# Altium schematic sheet [11]SERIAL_PORT.SchDoc
size B
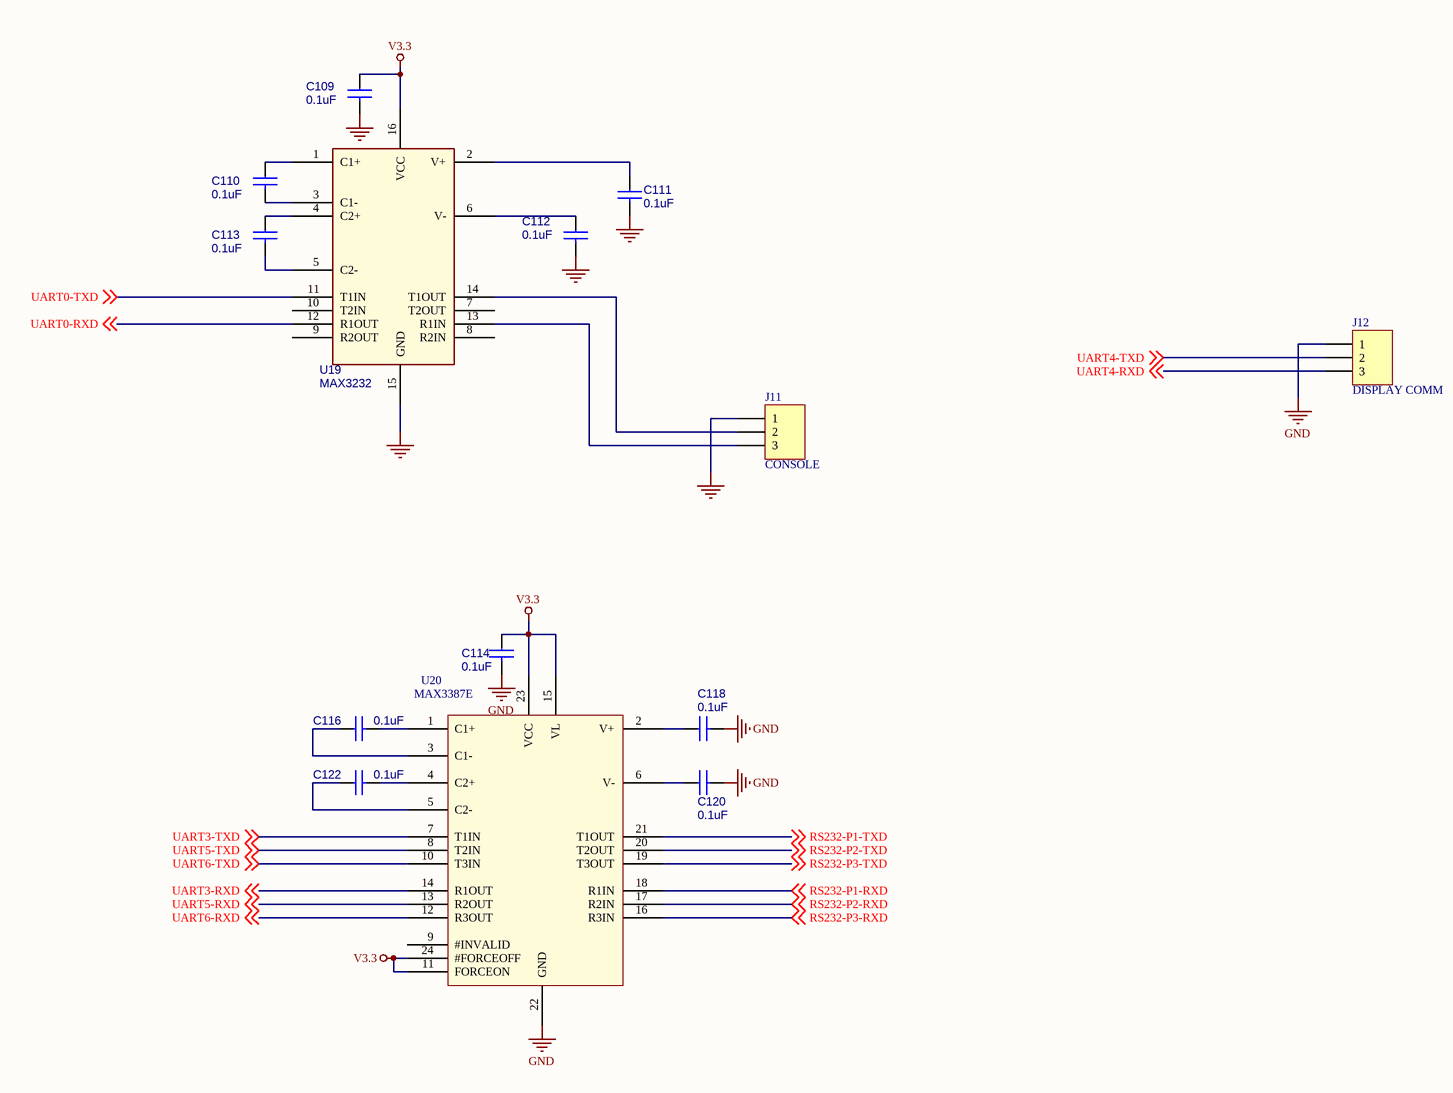
[diagram p0: [11]SERIAL_PORT.SchDoc]

## Parts
C109  0.1uF  [0603]
C110  0.1uF  [0603]
C111  0.1uF  [0603]
C112  0.1uF  [0603]
C113  0.1uF  [0603]
C114  0.1uF  [0603]
C116  0.1uF  [0603]
C118  0.1uF  [0603]
C120  0.1uF  [0603]
C122  0.1uF  [0603]
J11  CONSOLE  [CONN-3P]
J12  DISPLAY COMM  [CONN-3P]
U19  MAX3232  [SO-16]
U20  MAX3387E  [SSOP24]

## Nets
GND: C109.2 C111.2 C112.2 C114.2 C118.2 C120.2 J11.1 J12.1 U19.15(GND) U20.22(GND)
V3.3: C109.1 C114.1 U19.16(VCC) U20.11(FORCEON) U20.15(VL) U20.23(VCC) U20.24(#FORCEOFF)
RS232-P1-RXD: U20.18(R1IN) ; off-sheet RS232-P1-RXD
RS232-P1-TXD: U20.21(T1OUT) ; off-sheet RS232-P1-TXD
RS232-P2-RXD: U20.17(R2IN) ; off-sheet RS232-P2-RXD
RS232-P2-TXD: U20.20(T2OUT) ; off-sheet RS232-P2-TXD
RS232-P3-RXD: U20.16(R3IN) ; off-sheet RS232-P3-RXD
RS232-P3-TXD: U20.19(T3OUT) ; off-sheet RS232-P3-TXD
UART0-RXD: U19.12(R1OUT) ; off-sheet UART0-RXD
UART0-TXD: U19.11(T1IN) ; off-sheet UART0-TXD
UART3-RXD: U20.14(R1OUT) ; off-sheet UART3-RXD
UART3-TXD: U20.7(T1IN) ; off-sheet UART3-TXD
UART4-RXD: J12.3 ; off-sheet UART4-RXD
UART4-TXD: J12.2 ; off-sheet UART4-TXD
UART5-RXD: U20.13(R2OUT) ; off-sheet UART5-RXD
UART5-TXD: U20.8(T2IN) ; off-sheet UART5-TXD
UART6-RXD: U20.12(R3OUT) ; off-sheet UART6-RXD
UART6-TXD: U20.10(T3IN) ; off-sheet UART6-TXD
NetC110_1: C110.1 U19.1(C1+)
NetC110_2: C110.2 U19.3(C1-)
NetC111_1: C111.1 U19.2(V+)
NetC112_1: C112.1 U19.6(V-)
NetC113_1: C113.1 U19.4(C2+)
NetC113_2: C113.2 U19.5(C2-)
NetC116_1: C116.1 U20.3(C1-)
NetC116_2: C116.2 U20.1(C1+)
NetC118_1: C118.1 U20.2(V+)
NetC120_1: C120.1 U20.6(V-)
NetC122_1: C122.1 U20.5(C2-)
NetC122_2: C122.2 U20.4(C2+)
NetJ11_2: J11.2 U19.14(T1OUT)
NetJ11_3: J11.3 U19.13(R1IN)

Not connected (* = marked no-connect by the designer): U19 7(T2OUT) 8(R2IN) 9(R2OUT) 10(T2IN); U20 9(#INVALID)

## Library data of the parts
C109-C114 C116 C118 C120 C122 = CAP
J11 J12 = Header 3: Header, 3-Pin; LatestRevisionDate: 17-Jul-2002; LatestRevisionNote: Re-released for DXP Platform.; Publisher: Altium Limited